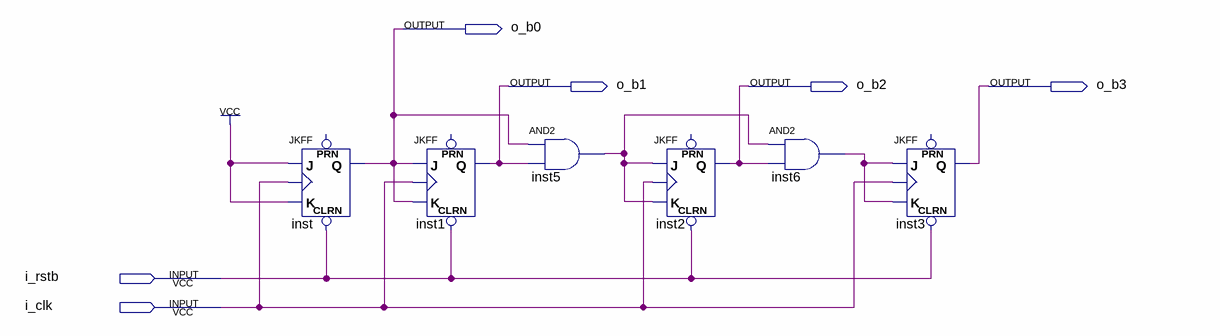
[diagram p0: schematic sheet]
// Quartus schematic counter_4bit.bdf as structural Verilog: 6 symbols, 6 pins
module counter_4bit (
  input  i_rstb,
  input  i_clk,
  output o_b0,
  output o_b1,
  output o_b2,
  output o_b3
);

  wire inst5_out, inst6_out;

  JKFF inst (.CLRN(i_rstb), .K(1'b1), .J(1'b1), .CLK(i_clk), .Q(o_b0));  // open: PRN
  JKFF inst1 (.CLRN(i_rstb), .K(o_b0), .J(o_b0), .CLK(i_clk), .Q(o_b1));  // open: PRN
  and inst5 (inst5_out, o_b0, o_b1);
  JKFF inst2 (.CLRN(i_rstb), .K(inst5_out), .J(inst5_out), .CLK(i_clk), .Q(o_b2));  // open: PRN
  and inst6 (inst6_out, inst5_out, o_b2);
  JKFF inst3 (.CLRN(i_rstb), .K(inst6_out), .J(inst6_out), .CLK(i_clk), .Q(o_b3));  // open: PRN
endmodule
